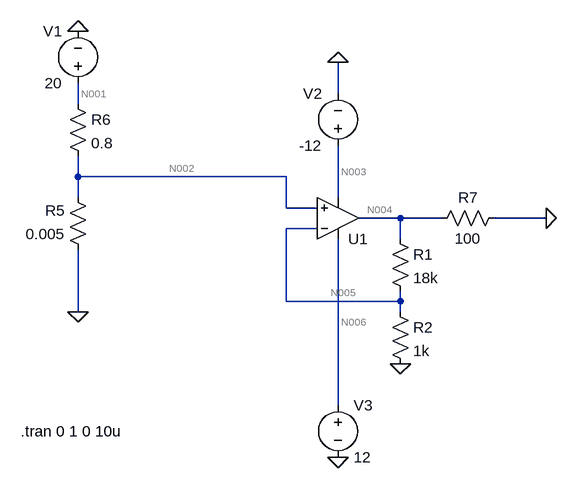
[diagram p0: schematic current-sensing-with-opamp.asc]
current-sensing-with-opamp.asc, the LTspice schematic file:
Version 4
SHEET 1 880 680
WIRE 272 -128 272 -176
WIRE -128 -112 -128 -144
WIRE -128 0 -128 -32
WIRE 192 0 -128 0
WIRE -128 32 -128 0
WIRE 272 32 272 -48
WIRE 192 48 192 0
WIRE 240 48 192 48
WIRE 368 64 304 64
WIRE 432 64 368 64
WIRE 592 64 512 64
WIRE 240 80 192 80
WIRE 368 96 368 64
WIRE 192 192 192 80
WIRE 368 192 368 176
WIRE 368 192 192 192
WIRE -128 208 -128 112
WIRE 368 208 368 192
WIRE 272 352 272 96
FLAG -128 -224 0
FLAG 272 -176 0
FLAG 272 432 0
FLAG 368 288 0
FLAG 592 64 0
FLAG -128 208 0
SYMBOL OpAmps\\UniversalOpAmp 272 64 M180
SYMATTR InstName U1
SYMBOL res -112 128 R180
WINDOW 0 36 76 Left 2
WINDOW 3 36 40 Left 2
SYMATTR InstName R5
SYMATTR Value 0.005
SYMBOL voltage -128 -128 R180
WINDOW 0 24 96 Left 2
WINDOW 3 24 16 Left 2
WINDOW 123 0 0 Left 0
WINDOW 39 0 0 Left 0
SYMATTR InstName V1
SYMATTR Value 20
SYMBOL voltage 272 -32 R180
WINDOW 0 24 96 Left 2
WINDOW 3 24 16 Left 2
WINDOW 123 0 0 Left 0
WINDOW 39 0 0 Left 0
SYMATTR InstName V2
SYMATTR Value -12
SYMBOL voltage 272 336 R0
WINDOW 123 0 0 Left 0
WINDOW 39 0 0 Left 0
SYMATTR InstName V3
SYMATTR Value 12
SYMBOL res -144 -128 R0
SYMATTR InstName R6
SYMATTR Value 0.8
SYMBOL res 352 192 R0
SYMATTR InstName R2
SYMATTR Value 1k
SYMBOL res 528 48 R90
WINDOW 0 0 56 VBottom 2
WINDOW 3 32 56 VTop 2
SYMATTR InstName R7
SYMATTR Value 100
SYMBOL res 352 80 R0
SYMATTR InstName R1
SYMATTR Value 18k
TEXT -216 392 Left 2 !.tran 0 1 0 10u

The netlist it stands for:
* current-sensing-with-opamp.asc
XU1 N002 N005 N006 N003 N004 level1 Avol=1Meg GBW=10Meg Vos=0 En=0 Enk=0 In=0 Ink=0 Rin=500Meg  ; pins In+ In- V+ V- OUT
R5 0 N002 0.005
V1 N001 0 20
V2 N003 0 -12
V3 N006 0 12
R6 N001 N002 0.8
R2 N005 0 1k
R7 0 N004 100
R1 N004 N005 18k
.tran 0 1 0 10u
.lib UniversalOpAmp1.lib
.backanno
.end

* Results of the author's LTspice run, read from the files saved beside the schematic
* Operating Point, zero values left out:
*   V(n005) = 124.2 mV
*   V(n002) = 124.2 mV
*   V(n004) = 2.36 V
*   V(n006) = 12 V
*   V(n003) = -12 V
*   V(n001) = 20 V
*   I(R1) = 124.2 µA
*   I(R7) = -23.6 mA
*   I(R2) = 124.2 µA
*   I(R6) = 24.84 A
*   I(R5) = -24.84 A
*   I(V3) = -23.75 nA
*   I(V2) = 24.25 nA
*   I(V1) = -24.84 A
*   Ix(u1:1) = 248.4 pA
*   Ix(u1:2) = 248.4 pA
*   Ix(u1:3) = 23.75 nA
*   Ix(u1:4) = -24.25 nA
*   Ix(u1:5) = -23.73 mA